# EAGLE schematic NerdKit (EAGLE 7.4.0)
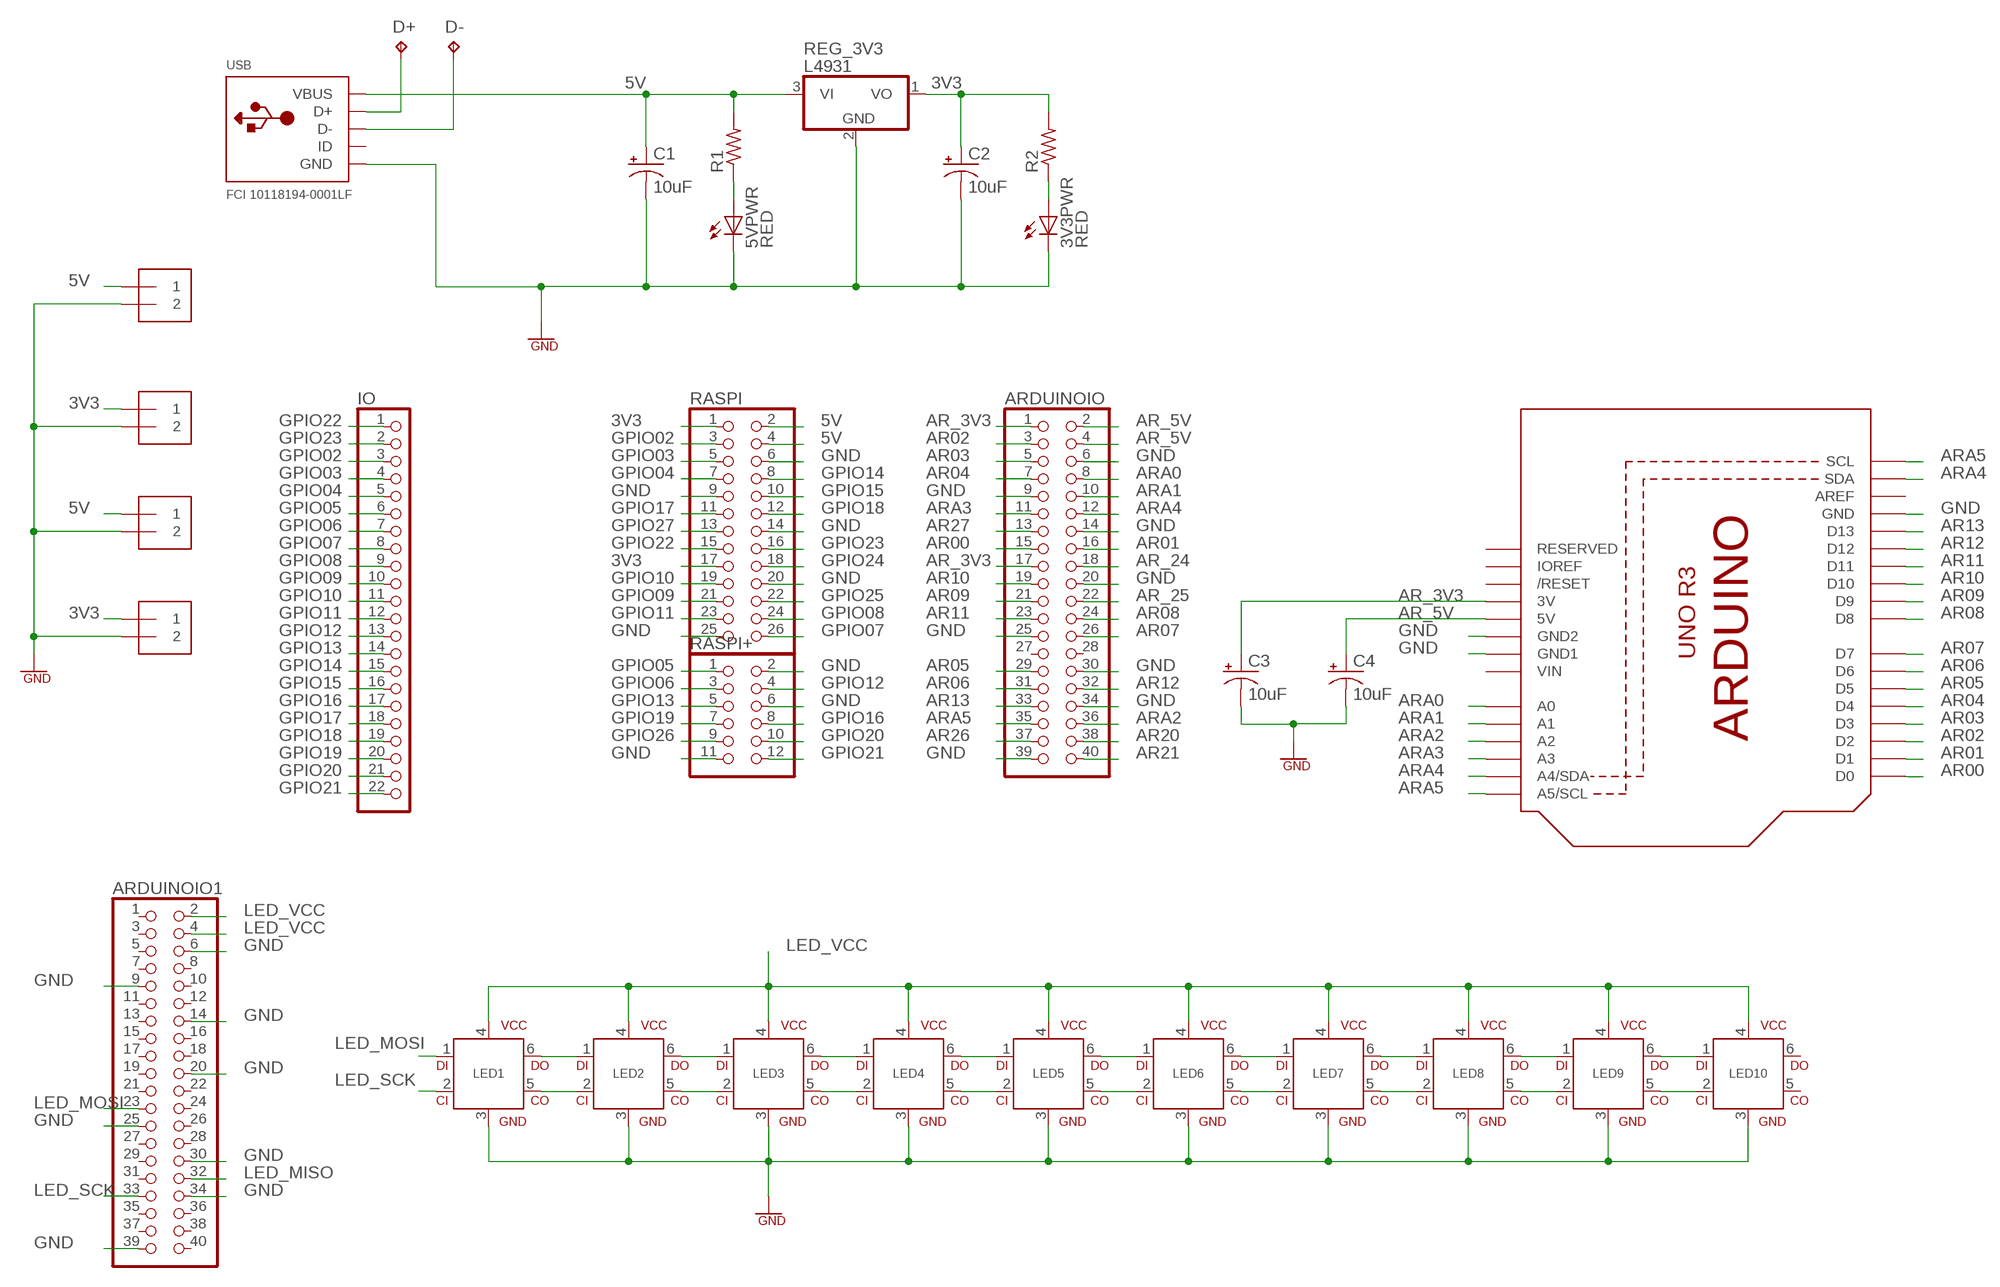
[diagram p0: schematic, sheet 1]

## Parts
3V3PWR  RED  LED3MM  [LED3MM]
5VPWR  RED  LED3MM  [LED3MM]
ARDUINOIO  PINHD-2X20  [2X20]
ARDUINOIO1  PINHD-2X20  [2X20]
C1  10uF  CPOL-USE1.8-4  [E1,8-4]
C2  10uF  CPOL-USE1.8-4  [E1,8-4]
C3  10uF  CPOL-USE1.8-4  [E1,8-4]
C4  10uF  CPOL-USE1.8-4  [E1,8-4]
D+  TPPAD1-13  [P1-13]
D-  TPPAD1-13  [P1-13]
IO  PINHD-1X22  [1X22]
LED1  RGBLED5050  [RGBLED5050]
LED2  RGBLED5050  [RGBLED5050]
LED3  RGBLED5050  [RGBLED5050]
LED4  RGBLED5050  [RGBLED5050]
LED5  RGBLED5050  [RGBLED5050]
LED6  RGBLED5050  [RGBLED5050]
LED7  RGBLED5050  [RGBLED5050]
LED8  RGBLED5050  [RGBLED5050]
LED9  RGBLED5050  [RGBLED5050]
LED10  RGBLED5050  [RGBLED5050]
PB1_TB_3V3  1X2-3.5MM  [1X2-3.5MM]
PB1_TB_5V  1X2-3.5MM  [1X2-3.5MM]
PB2_TB_3V3  1X2-3.5MM  [1X2-3.5MM]
PB2_TB_5V  1X2-3.5MM  [1X2-3.5MM]
R1  R-US_0207/7  [0207/7]
R2  R-US_0207/7  [0207/7]
RASPI  PINHD-2X13  [2X13]
RASPI+  PINHD-2X6  [2X06]
REG_3V3  L4931  7808L  [TO92]
U2  ARDUINOR3-PINSONLY  [ARDUINOR3_PINSONLY]
USB  FCI 10118194-0001LF  USBMICRO_20329  [4UCONN_20329]

## Nets
3V3: C2.+ PB1_TB_3V3.1 PB2_TB_3V3.1 R2.2 RASPI.1 RASPI.17 REG_3V3.1(VO)
5V: C1.+ PB1_TB_5V.1 PB2_TB_5V.1 R1.2 RASPI.2 RASPI.4 REG_3V3.3(VI) USB.VBUS
AR00: ARDUINOIO.15 U2.D0
AR01: ARDUINOIO.16 U2.D1
AR02: ARDUINOIO.3 U2.D2
AR03: ARDUINOIO.5 U2.D3
AR04: ARDUINOIO.7 U2.D4
AR05: ARDUINOIO.29 U2.D5
AR06: ARDUINOIO.31 U2.D6
AR07: ARDUINOIO.26 U2.D7
AR08: ARDUINOIO.24 U2.D8
AR09: ARDUINOIO.21 U2.D9
AR10: ARDUINOIO.19 U2.D10
AR11: ARDUINOIO.23 U2.D11
AR12: ARDUINOIO.32 U2.D12
AR13: ARDUINOIO.33 U2.D13
AR20: ARDUINOIO.38
AR21: ARDUINOIO.40
AR26: ARDUINOIO.37
AR27: ARDUINOIO.13
AR_3V3: ARDUINOIO.1 ARDUINOIO.17 C3.+ U2.3V
AR_5V: ARDUINOIO.2 ARDUINOIO.4 C4.+ U2.5V
AR_24: ARDUINOIO.18
AR_25: ARDUINOIO.22
ARA0: ARDUINOIO.8 U2.A0
ARA1: ARDUINOIO.10 U2.A1
ARA2: ARDUINOIO.36 U2.A2
ARA3: ARDUINOIO.11 U2.A3
ARA4: ARDUINOIO.12 U2.A4(A4/SDA) U2.SDA
ARA5: ARDUINOIO.35 U2.A5(A5/SCL) U2.SCL
GND: 3V3PWR.K(C) 5VPWR.K(C) ARDUINOIO1.6 ARDUINOIO1.9 ARDUINOIO1.14 ARDUINOIO1.20 ARDUINOIO1.25 ARDUINOIO1.30 ARDUINOIO1.34 ARDUINOIO1.39 ARDUINOIO.6 ARDUINOIO.9 ARDUINOIO.14 ARDUINOIO.20 ARDUINOIO.25 ARDUINOIO.30 ARDUINOIO.34 ARDUINOIO.39 C1.- C2.- C3.- C4.- LED1.3(GND) LED2.3(GND) LED3.3(GND) LED4.3(GND) LED5.3(GND) LED6.3(GND) LED7.3(GND) LED8.3(GND) LED9.3(GND) LED10.3(GND) PB1_TB_3V3.2 PB1_TB_5V.2 PB2_TB_3V3.2 PB2_TB_5V.2 RASPI+.2 RASPI+.6 RASPI+.11 RASPI.6 RASPI.9 RASPI.14 RASPI.20 RASPI.25 REG_3V3.2(GND) U2.GND U2.GND1 U2.GND2 USB.BASE@1(GND) USB.BASE@2(GND) USB.GND USB.SPRT@1(GND) USB.SPRT@2(GND) USB.SPRT@3(GND) USB.SPRT@4(GND)
GPIO02: IO.3 RASPI.3
GPIO03: IO.4 RASPI.5
GPIO04: IO.5 RASPI.7
GPIO05: IO.6 RASPI+.1
GPIO06: IO.7 RASPI+.3
GPIO07: IO.8 RASPI.26
GPIO08: IO.9 RASPI.24
GPIO09: IO.10 RASPI.21
GPIO10: IO.11 RASPI.19
GPIO11: IO.12 RASPI.23
GPIO12: IO.13 RASPI+.4
GPIO13: IO.14 RASPI+.5
GPIO14: IO.15 RASPI.8
GPIO15: IO.16 RASPI.10
GPIO16: IO.17 RASPI+.8
GPIO17: IO.18 RASPI.11
GPIO18: IO.19 RASPI.12
GPIO19: IO.20 RASPI+.7
GPIO20: IO.21 RASPI+.10
GPIO21: IO.22 RASPI+.12
GPIO22: IO.1 RASPI.15
GPIO23: IO.2 RASPI.16
GPIO24: RASPI.18
GPIO25: RASPI.22
GPIO26: RASPI+.9
GPIO27: RASPI.13
LED_MISO: ARDUINOIO1.32
LED_MOSI: ARDUINOIO1.23 LED1.1(DI)
LED_SCK: ARDUINOIO1.33 LED1.2(CI)
LED_VCC [5V]: ARDUINOIO1.2 ARDUINOIO1.4 LED1.4(VCC) LED2.4(VCC) LED3.4(VCC) LED4.4(VCC) LED5.4(VCC) LED6.4(VCC) LED7.4(VCC) LED8.4(VCC) LED9.4(VCC) LED10.4(VCC)
N$1: 3V3PWR.A R2.1
N$2: D+.TP USB.D+
N$3: LED1.6(DO) LED2.1(DI)
N$4: LED1.5(CO) LED2.2(CI)
N$5: LED2.6(DO) LED3.1(DI)
N$6: LED2.5(CO) LED3.2(CI)
N$7: LED3.6(DO) LED4.1(DI)
N$8: LED3.5(CO) LED4.2(CI)
N$9: LED4.6(DO) LED5.1(DI)
N$10: LED4.5(CO) LED5.2(CI)
N$11: LED5.6(DO) LED6.1(DI)
N$12: LED5.5(CO) LED6.2(CI)
N$13: LED6.6(DO) LED7.1(DI)
N$14: LED6.5(CO) LED7.2(CI)
N$15: LED7.6(DO) LED8.1(DI)
N$16: LED7.5(CO) LED8.2(CI)
N$17: LED8.6(DO) LED9.1(DI)
N$18: LED8.5(CO) LED9.2(CI)
N$19: LED9.6(DO) LED10.1(DI)
N$20: LED9.5(CO) LED10.2(CI)
N$21: D-.TP USB.D-
N$31: 5VPWR.A R1.1
Unconnected: ARDUINOIO1.1 ARDUINOIO1.3 ARDUINOIO1.5 ARDUINOIO1.7 ARDUINOIO1.8 ARDUINOIO1.10 ARDUINOIO1.11 ARDUINOIO1.12 ARDUINOIO1.13 ARDUINOIO1.15 ARDUINOIO1.16 ARDUINOIO1.17 ARDUINOIO1.18 ARDUINOIO1.19 ARDUINOIO1.21 ARDUINOIO1.22 ARDUINOIO1.24 ARDUINOIO1.26 ARDUINOIO1.27 ARDUINOIO1.28 ARDUINOIO1.29 ARDUINOIO1.31 ARDUINOIO1.35 ARDUINOIO1.36 ARDUINOIO1.37 ARDUINOIO1.38 ARDUINOIO1.40 ARDUINOIO.27 ARDUINOIO.28 LED10.5(CO) LED10.6(DO) U2.AREF U2.IOREF U2.RESERVED U2.RESET(/RESET) USB.ID

## Power pins joined to a net without a drawn wire
VIN: U2.VIN

## Library data of the parts
3V3PWR 5VPWR = adafruit:LED: LED OSRAM: - CHIPLED LG R971, LG N971, LY N971, LG Q971, LY Q971, LO R971, LY R971 LH N974, LH R974 LS Q976, LO Q976, LY Q976 LO Q996 - Hyper CHIPLED LW Q18S LB Q993, LB Q99A, LB R99A - SideLED LS A670, LO A670, LY A670, LG A670, LP A670 LB A673, LV A673, LT A673, LW A673 LH A674 LY A675 LS A676, LA A676, LO A676, LY A676, LW A676 LS A679, LY A679, LG A679 - Hyper Micro SIDELED® LS Y876, LA Y876, LO Y876, LY Y876 LT Y87S - SmartLED LW L88C, LW L88S LB L89C, LB L89S, LG L890 LS L89K, LO L89K, LY L89K LS L896, LA L896, LO L896, LY L896 - TOPLED LS T670, LO T670, LY T670, LG T670, LP T670 LSG T670, LSP T670, LSY T670, LOP T670, LYG T670 LG T671, LOG T671, LSG T671 LB T673, LV T673, LT T673, LW T673 LH T674 LS T676, LA T676, LO T676, LY T676, LB T676, LH T676, LSB T676, LW T676 LB T67C, LV T67C, LT T67C, LS T67K, LO T67K, LY T67K, LW E67C LS E67B, LA E67B, LO E67B, LY E67B, LB E67C, LV E67C, LT E67C LW T67C LS T679, LY T679, LG T679 LS T770, LO T770, LY T770, LG T770, LP T770 LB T773, LV T773, LT T773, LW T773 LH T774 LS E675, LA E675, LY E675, LS T675 LS T776, LA T776, LO T776, LY T776, LB T776 LHGB T686 LT T68C, LB T68C - Hyper Mini TOPLED® LB M676 - Mini TOPLED Santana® LG M470 LS M47K, LO M47K, LY M47K Source: http://www.osram.convergy.de/
ARDUINOIO ARDUINOIO1 = pinhead:PINHD-2X20: PIN HEADER
C1-C4 = adafruit:CPOL-US: POLARIZED CAPACITOR, American symbol
D+ D- = testpad:TP: Test pad
IO = pinhead:PINHD-1X22: PIN HEADER
LED1-LED10 = osborn:RGBLED: For 5050 RGB LEDs, the order of the LEDs may vary from one manufacturer to another!
PB1_TB_3V3 PB1_TB_5V PB2_TB_3V3 PB2_TB_5V = adafruit:1X2: 3.5mm Terminal block http://www.ladyada.net/library/pcb/eaglelibrary.html
R1 R2 = adafruit:R-US_: RESISTOR, American symbol
RASPI = pinhead:PINHD-2X13: PIN HEADER
RASPI+ = pinhead:PINHD-2X6: PIN HEADER
REG_3V3 = adafruit:78*: Positive VOLTAGE REGULATOR Added bigger pads to the TO-92 package
U2 = osborn:ARDUINOR3: This is a new object for the new Arduino R3 - with extra pins that you may want to use (such as IOref, and duplicated A4/A5
USB = microbuilder:USB: USB Connectors USBMINIB - Surface Mount Female Mini-B USB Connector 4UConnector: 06564

## Net classes
1 GND: width 0.61 mm
2 5V: width 0.61 mm
3 3V3: width 0.61 mm